# EAGLE design BitUDCounter (EAGLE 9.2.2)
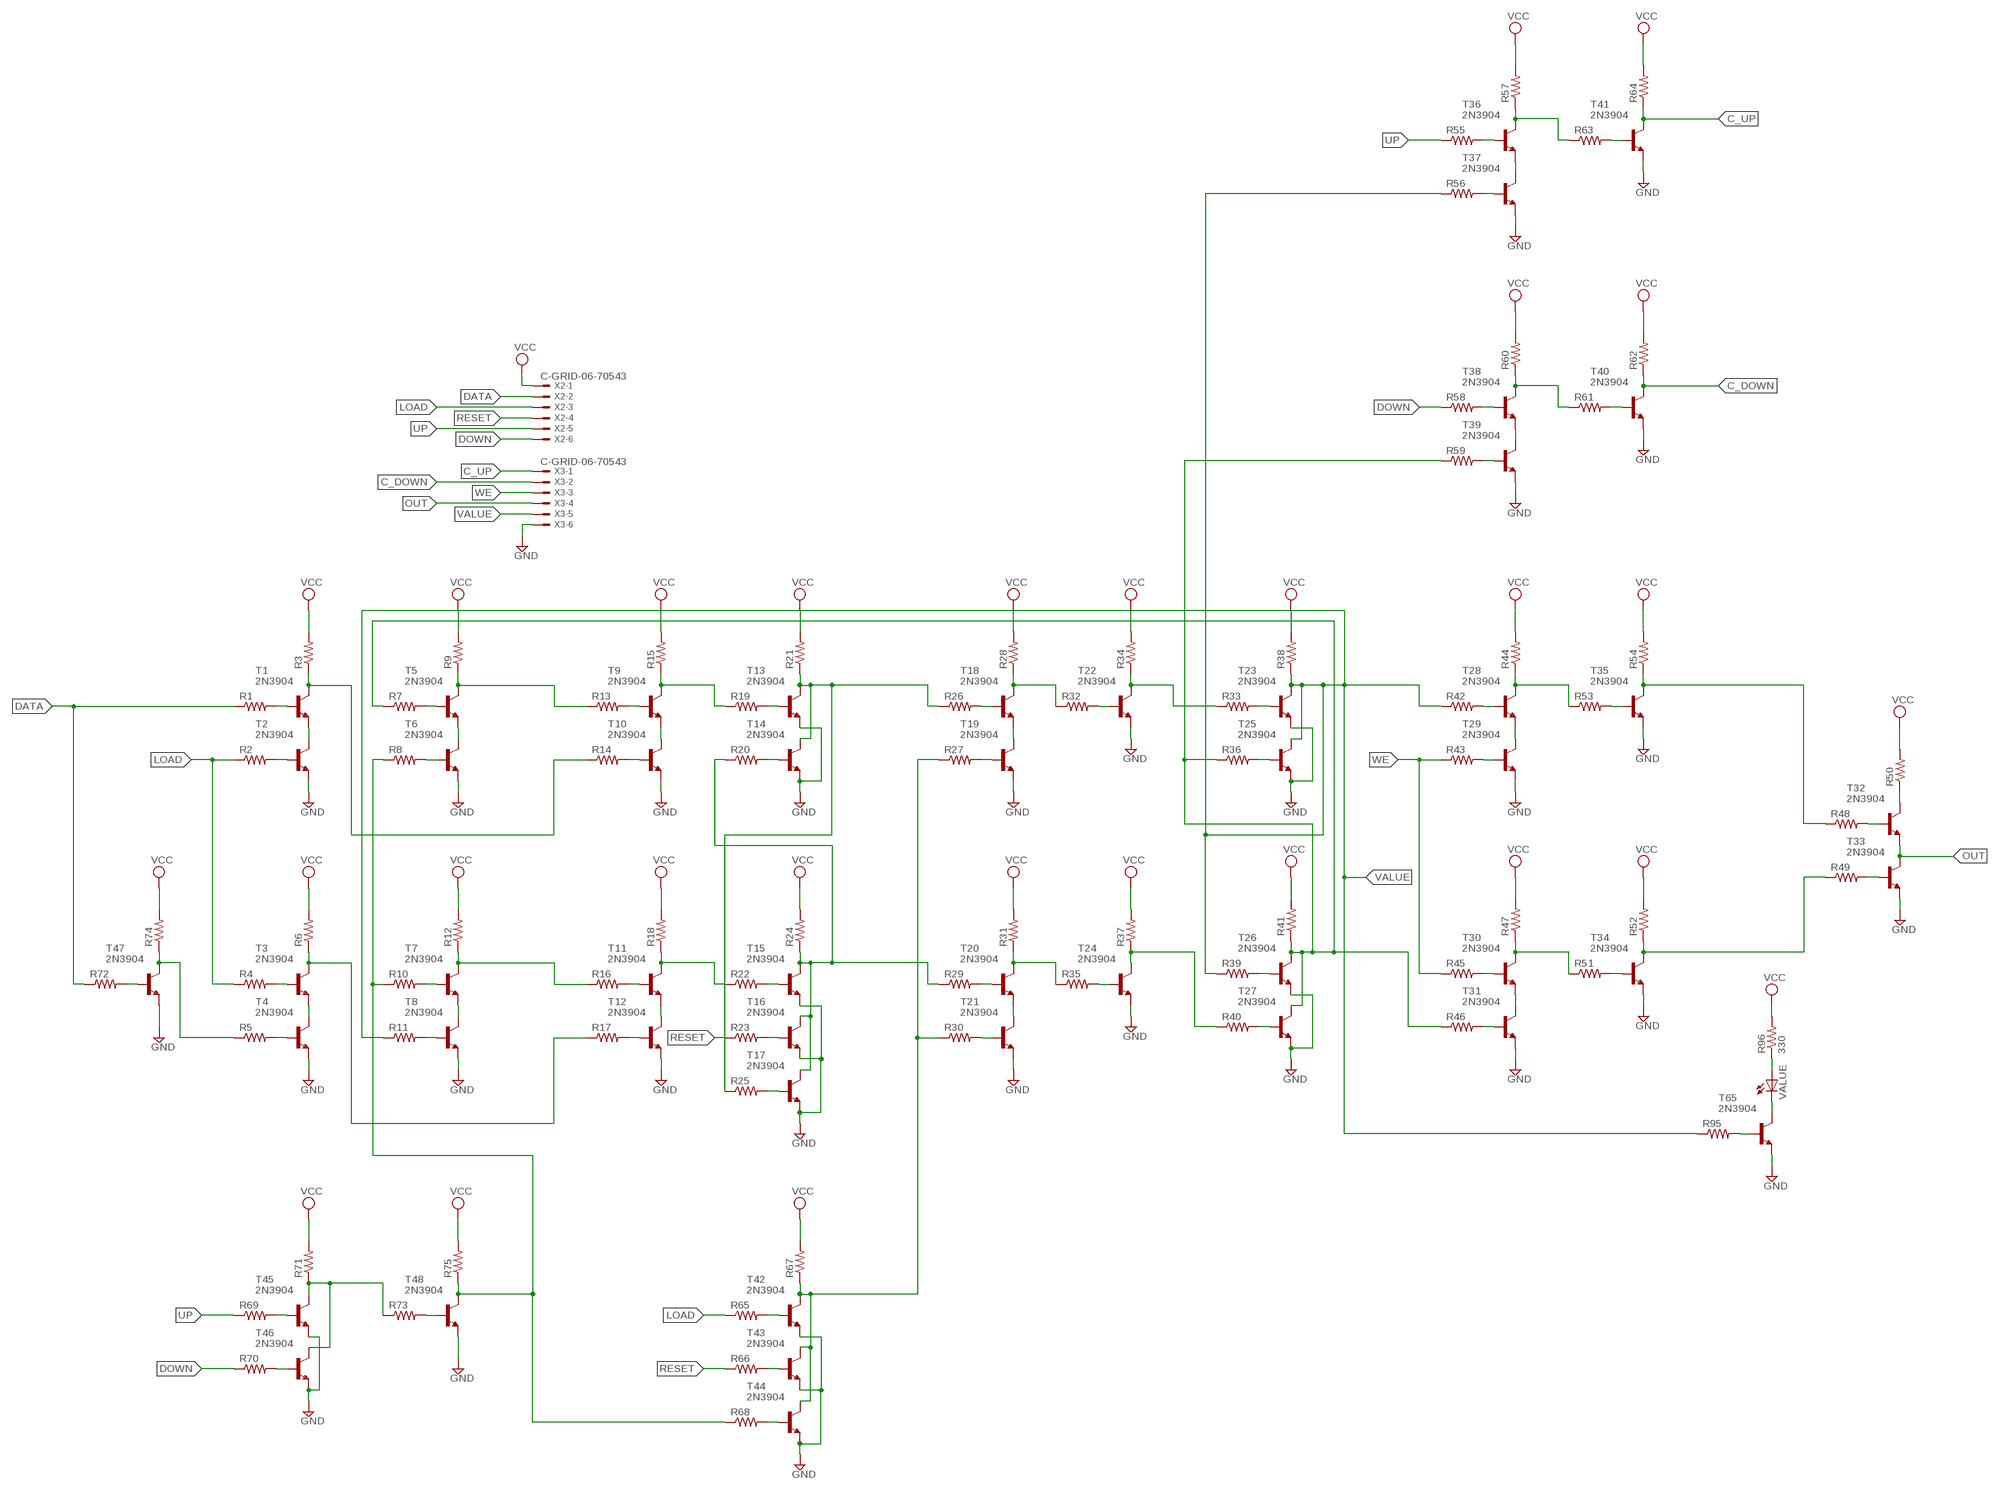
[diagram p0: schematic, sheet 1]

## Parts
R1  R-US_0309/10  [0309/10]
R2  R-US_0309/10  [0309/10]
R3  R-US_0309/10  [0309/10]
R4  R-US_0309/10  [0309/10]
R5  R-US_0309/10  [0309/10]
R6  R-US_0309/10  [0309/10]
R7  R-US_0309/10  [0309/10]
R8  R-US_0309/10  [0309/10]
R9  R-US_0309/10  [0309/10]
R10  R-US_0309/10  [0309/10]
R11  R-US_0309/10  [0309/10]
R12  R-US_0309/10  [0309/10]
R13  R-US_0309/10  [0309/10]
R14  R-US_0309/10  [0309/10]
R15  R-US_0309/10  [0309/10]
R16  R-US_0309/10  [0309/10]
R17  R-US_0309/10  [0309/10]
R18  R-US_0309/10  [0309/10]
R19  R-US_0309/10  [0309/10]
R20  R-US_0309/10  [0309/10]
R21  R-US_0309/10  [0309/10]
R22  R-US_0309/10  [0309/10]
R23  R-US_0309/10  [0309/10]
R24  R-US_0309/10  [0309/10]
R25  R-US_0309/10  [0309/10]
R26  R-US_0309/10  [0309/10]
R27  R-US_0309/10  [0309/10]
R28  R-US_0309/10  [0309/10]
R29  R-US_0309/10  [0309/10]
R30  R-US_0309/10  [0309/10]
R31  R-US_0309/10  [0309/10]
R32  R-US_0309/10  [0309/10]
R33  R-US_0309/10  [0309/10]
R34  R-US_0309/10  [0309/10]
R35  R-US_0309/10  [0309/10]
R36  R-US_0309/10  [0309/10]
R37  R-US_0309/10  [0309/10]
R38  R-US_0309/10  [0309/10]
R39  R-US_0309/10  [0309/10]
R40  R-US_0309/10  [0309/10]
R41  R-US_0309/10  [0309/10]
R42  R-US_0309/10  [0309/10]
R43  R-US_0309/10  [0309/10]
R44  R-US_0309/10  [0309/10]
R45  R-US_0309/10  [0309/10]
R46  R-US_0309/10  [0309/10]
R47  R-US_0309/10  [0309/10]
R48  R-US_0309/10  [0309/10]
R49  R-US_0309/10  [0309/10]
R50  R-US_0309/10  [0309/10]
R51  R-US_0309/10  [0309/10]
R52  R-US_0309/10  [0309/10]
R53  R-US_0309/10  [0309/10]
R54  R-US_0309/10  [0309/10]
R55  R-US_0309/10  [0309/10]
R56  R-US_0309/10  [0309/10]
R57  R-US_0309/10  [0309/10]
R58  R-US_0309/10  [0309/10]
R59  R-US_0309/10  [0309/10]
R60  R-US_0309/10  [0309/10]
R61  R-US_0309/10  [0309/10]
R62  R-US_0309/10  [0309/10]
R63  R-US_0309/10  [0309/10]
R64  R-US_0309/10  [0309/10]
R65  R-US_0309/10  [0309/10]
R66  R-US_0309/10  [0309/10]
R67  R-US_0309/10  [0309/10]
R68  R-US_0309/10  [0309/10]
R69  R-US_0309/10  [0309/10]
R70  R-US_0309/10  [0309/10]
R71  R-US_0309/10  [0309/10]
R72  R-US_0309/10  [0309/10]
R73  R-US_0309/10  [0309/10]
R74  R-US_0309/10  [0309/10]
R75  R-US_0309/10  [0309/10]
R95  R-US_0309/10  [0309/10]
R96  330  R-US_0309/10  [0309/10]
T1  2N3904  [TO92]
T2  2N3904  [TO92]
T3  2N3904  [TO92]
T4  2N3904  [TO92]
T5  2N3904  [TO92]
T6  2N3904  [TO92]
T7  2N3904  [TO92]
T8  2N3904  [TO92]
T9  2N3904  [TO92]
T10  2N3904  [TO92]
T11  2N3904  [TO92]
T12  2N3904  [TO92]
T13  2N3904  [TO92]
T14  2N3904  [TO92]
T15  2N3904  [TO92]
T16  2N3904  [TO92]
T17  2N3904  [TO92]
T18  2N3904  [TO92]
T19  2N3904  [TO92]
T20  2N3904  [TO92]
T21  2N3904  [TO92]
T22  2N3904  [TO92]
T23  2N3904  [TO92]
T24  2N3904  [TO92]
T25  2N3904  [TO92]
T26  2N3904  [TO92]
T27  2N3904  [TO92]
T28  2N3904  [TO92]
T29  2N3904  [TO92]
T30  2N3904  [TO92]
T31  2N3904  [TO92]
T32  2N3904  [TO92]
T33  2N3904  [TO92]
T34  2N3904  [TO92]
T35  2N3904  [TO92]
T36  2N3904  [TO92]
T37  2N3904  [TO92]
T38  2N3904  [TO92]
T39  2N3904  [TO92]
T40  2N3904  [TO92]
T41  2N3904  [TO92]
T42  2N3904  [TO92]
T43  2N3904  [TO92]
T44  2N3904  [TO92]
T45  2N3904  [TO92]
T46  2N3904  [TO92]
T47  2N3904  [TO92]
T48  2N3904  [TO92]
T65  2N3904  [TO92]
VALUE  LED5MM  [LED5MM]
X2  C-GRID-06-70543  [70543-06]
X3  C-GRID-06-70543  [70543-06]

## Nets
C_DOWN: R62.1 T40.1(C) X3.2
C_UP: R64.1 T41.1(C) X3.1
DATA: R1.1 R72.1 X2.2
DOWN: R58.1 R70.1 X2.6
GND: T2.3(E) T4.3(E) T6.3(E) T8.3(E) T10.3(E) T12.3(E) T13.3(E) T14.3(E) T15.3(E) T16.3(E) T17.3(E) T19.3(E) T21.3(E) T22.3(E) T23.3(E) T24.3(E) T25.3(E) T26.3(E) T27.3(E) T29.3(E) T31.3(E) T33.3(E) T34.3(E) T35.3(E) T37.3(E) T39.3(E) T40.3(E) T41.3(E) T42.3(E) T43.3(E) T44.3(E) T45.3(E) T46.3(E) T47.3(E) T48.3(E) T65.3(E) X3.6
LOAD: R2.1 R4.1 R65.1 X2.3
N$1: R5.1 R74.1 T47.1(C)
N$2: R72.2 T47.2(B)
N$3: R71.1 R73.1 T45.1(C) T46.1(C)
N$5: R6.1 R17.1 T3.1(C)
N$6: R69.2 T45.2(B)
N$7: R70.2 T46.2(B)
N$8: R73.2 T48.2(B)
N$9: T3.3(E) T4.1(C)
N$10: R5.2 T4.2(B)
N$11: R4.2 T3.2(B)
N$12: R2.2 T2.2(B)
N$13: R1.2 T1.2(B)
N$14: T1.3(E) T2.1(C)
N$15: R3.1 R14.1 T1.1(C)
N$16: R9.1 R13.1 T5.1(C)
N$17: R7.2 T5.2(B)
N$18: R8.2 T6.2(B)
N$19: T5.3(E) T6.1(C)
N$20: R12.1 R16.1 T7.1(C)
N$21: R10.2 T7.2(B)
N$22: R11.2 T8.2(B)
N$23: T7.3(E) T8.1(C)
N$24: R18.1 R22.1 T11.1(C)
N$25: R16.2 T11.2(B)
N$26: R17.2 T12.2(B)
N$27: T11.3(E) T12.1(C)
N$28: R14.2 T10.2(B)
N$29: T9.3(E) T10.1(C)
N$30: R15.1 R19.1 T9.1(C)
N$31: R13.2 T9.2(B)
N$32: R21.1 R25.1 R26.1 T13.1(C) T14.1(C)
N$34: R19.2 T13.2(B)
N$35: R20.2 T14.2(B)
N$36: R20.1 R24.1 R29.1 T15.1(C) T16.1(C) T17.1(C)
N$37: R8.1 R10.1 R68.1 R75.1 T48.1(C)
N$40: R22.2 T15.2(B)
N$41: R23.2 T16.2(B)
N$42: R25.2 T17.2(B)
N$43: R30.2 T21.2(B)
N$44: T20.3(E) T21.1(C)
N$45: R31.1 R35.1 T20.1(C)
N$46: R29.2 T20.2(B)
N$47: R35.2 T24.2(B)
N$49: R26.2 T18.2(B)
N$50: R27.2 T19.2(B)
N$51: T18.3(E) T19.1(C)
N$52: R28.1 R32.1 T18.1(C)
N$53: R32.2 T22.2(B)
N$54: R33.1 R34.1 T22.1(C)
N$58: R36.2 T25.2(B)
N$59: R33.2 T23.2(B)
N$60: R7.1 R36.1 R41.1 R46.1 R59.1 T26.1(C) T27.1(C)
N$62: R39.2 T26.2(B)
N$63: R40.2 T27.2(B)
N$64: R42.2 T28.2(B)
N$65: R43.2 T29.2(B)
N$66: T28.3(E) T29.1(C)
N$67: R44.1 R53.1 T28.1(C)
N$68: R53.2 T35.2(B)
N$69: R48.1 R54.1 T35.1(C)
N$70: R49.1 R52.1 T34.1(C)
N$71: R51.2 T34.2(B)
N$72: R47.1 R51.1 T30.1(C)
N$73: T30.3(E) T31.1(C)
N$74: R46.2 T31.2(B)
N$75: R45.2 T30.2(B)
N$76: R48.2 T32.2(B)
N$77: R50.1 T32.1(C)
N$79: R49.2 T33.2(B)
N$84: R57.1 R63.1 T36.1(C)
N$85: T36.3(E) T37.1(C)
N$86: R56.2 T37.2(B)
N$87: R55.2 T36.2(B)
N$89: R63.2 T41.2(B)
N$91: R65.2 T42.2(B)
N$92: R61.2 T40.2(B)
N$93: R60.1 R61.1 T38.1(C)
N$94: T38.3(E) T39.1(C)
N$95: R59.2 T39.2(B)
N$96: R58.2 T38.2(B)
N$97: R66.2 T43.2(B)
N$98: R68.2 T44.2(B)
N$100: R27.1 R30.1 R67.1 T42.1(C) T43.1(C) T44.1(C)
N$102: R37.1 R40.1 T24.1(C)
N$121: R96.1 VALUE.A
N$122: R95.2 T65.2(B)
N$124: T65.1(C) VALUE.K(C)
OUT: T32.3(E) T33.1(C) X3.4
RESET: R23.1 R66.1 X2.4
UP: R55.1 R69.1 X2.5
VALUE: R11.1 R38.1 R39.1 R42.1 R56.1 R95.1 T23.1(C) T25.1(C) X3.5
VCC: R3.2 R6.2 R9.2 R12.2 R15.2 R18.2 R21.2 R24.2 R28.2 R31.2 R34.2 R37.2 R38.2 R41.2 R44.2 R47.2 R50.2 R52.2 R54.2 R57.2 R60.2 R62.2 R64.2 R67.2 R71.2 R74.2 R75.2 R96.2 X2.1
WE: R43.1 R45.1 X3.3

## Library data of the parts
R1-R75 R95 R96 = resistor:R-US_: RESISTOR, American symbol
T1-T48 T65 = transistor:2N3904: NPN TRANSISTOR
VALUE = led:LED: LED OSRAM: - CHIPLED LG R971, LG N971, LY N971, LG Q971, LY Q971, LO R971, LY R971 LH N974, LH R974 LS Q976, LO Q976, LY Q976 LO Q996 - Hyper CHIPLED LW Q18S LB Q993, LB Q99A, LB R99A - SideLED LS A670, LO A670, LY A670, LG A670, LP A670 LB A673, LV A673, LT A673, LW A673 LH A674 LY A675 LS A676, LA A676, LO A676, LY A676, LW A676 LS A679, LY A679, LG A679 - Hyper Micro SIDELED® LS Y876, LA Y876, LO Y876, LY Y876 LT Y87S - SmartLED LW L88C, LW L88S LB L89C, LB L89S, LG L890 LS L89K, LO L89K, LY L89K LS L896, LA L896, LO L896, LY L896 - TOPLED LS T670, LO T670, LY T670, LG T670, LP T670 LSG T670, LSP T670, LSY T670, LOP T670, LYG T670 LG T671, LOG T671, LSG T671 LB T673, LV T673, LT T673, LW T673 LH T674 LS T676, LA T676, LO T676, LY T676, LB T676, LH T676, LSB T676, LW T676 LB T67C, LV T67C, LT T67C, LS T67K, LO T67K, LY T67K, LW E67C LS E67B, LA E67B, LO E67B, LY E67B, LB E67C, LV E67C, LT E67C LW T67C LS T679, LY T679, LG T679 LS T770, LO T770, LY T770, LG T770, LP T770 LB T773, LV T773, LT T773, LW T773 LH T774 LS E675, LA E675, LY E675, LS T675 LS T776, LA T776, LO T776, LY T776, LB T776 LHGB T686 LT T68C, LB T68C - Hyper Mini TOPLED® LB M676 - Mini TOPLED Santana® LG M470 LS M47K, LO M47K, LY M47K Source: http://www.osram.convergy.de LUXEON: - LUMILED® LXK2-PW12-R00, LXK2-PW12-S00, LXK2-PW14-U00, LXK2-PW14-V00 LXK2-PM12-R00, LXK2-PM12-S00, LXK2-PM14-U00 LXK2-PE12-Q00, LXK2-PE12-R00, LXK2-PE12-S00, LXK2-PE14-T00, LXK2-PE14-U00 LXK2-PB12-K00, LXK2-PB12-L00, LXK2-PB12-M00, LXK2-PB14-N00, LXK2-PB14-P00, LXK2-PB14-Q00 LXK2-PR12-L00, LXK2-PR12-M00, LXK2-PR14-Q00, LXK2-PR14-R00 LXK2-PD12-Q00, LXK2-PD12-R00, LXK2-PD12-S00 LXK2-PH12-R00, LXK2-PH12-S00 LXK2-PL12-P00, LXK2-PL12-Q00, LXK2-PL12-R00 Source: www.luxeon.com KINGBRIGHT: KA-3528ASYC Source: www.kingbright.com
X2 X3 = con-molex:C-GRID-06: CONNECTOR wire to board 2.54 mm (0.100") pitch header; MF: MOLEX; OC_FARNELL: unknown; OC_NEWARK: unknown

## Board
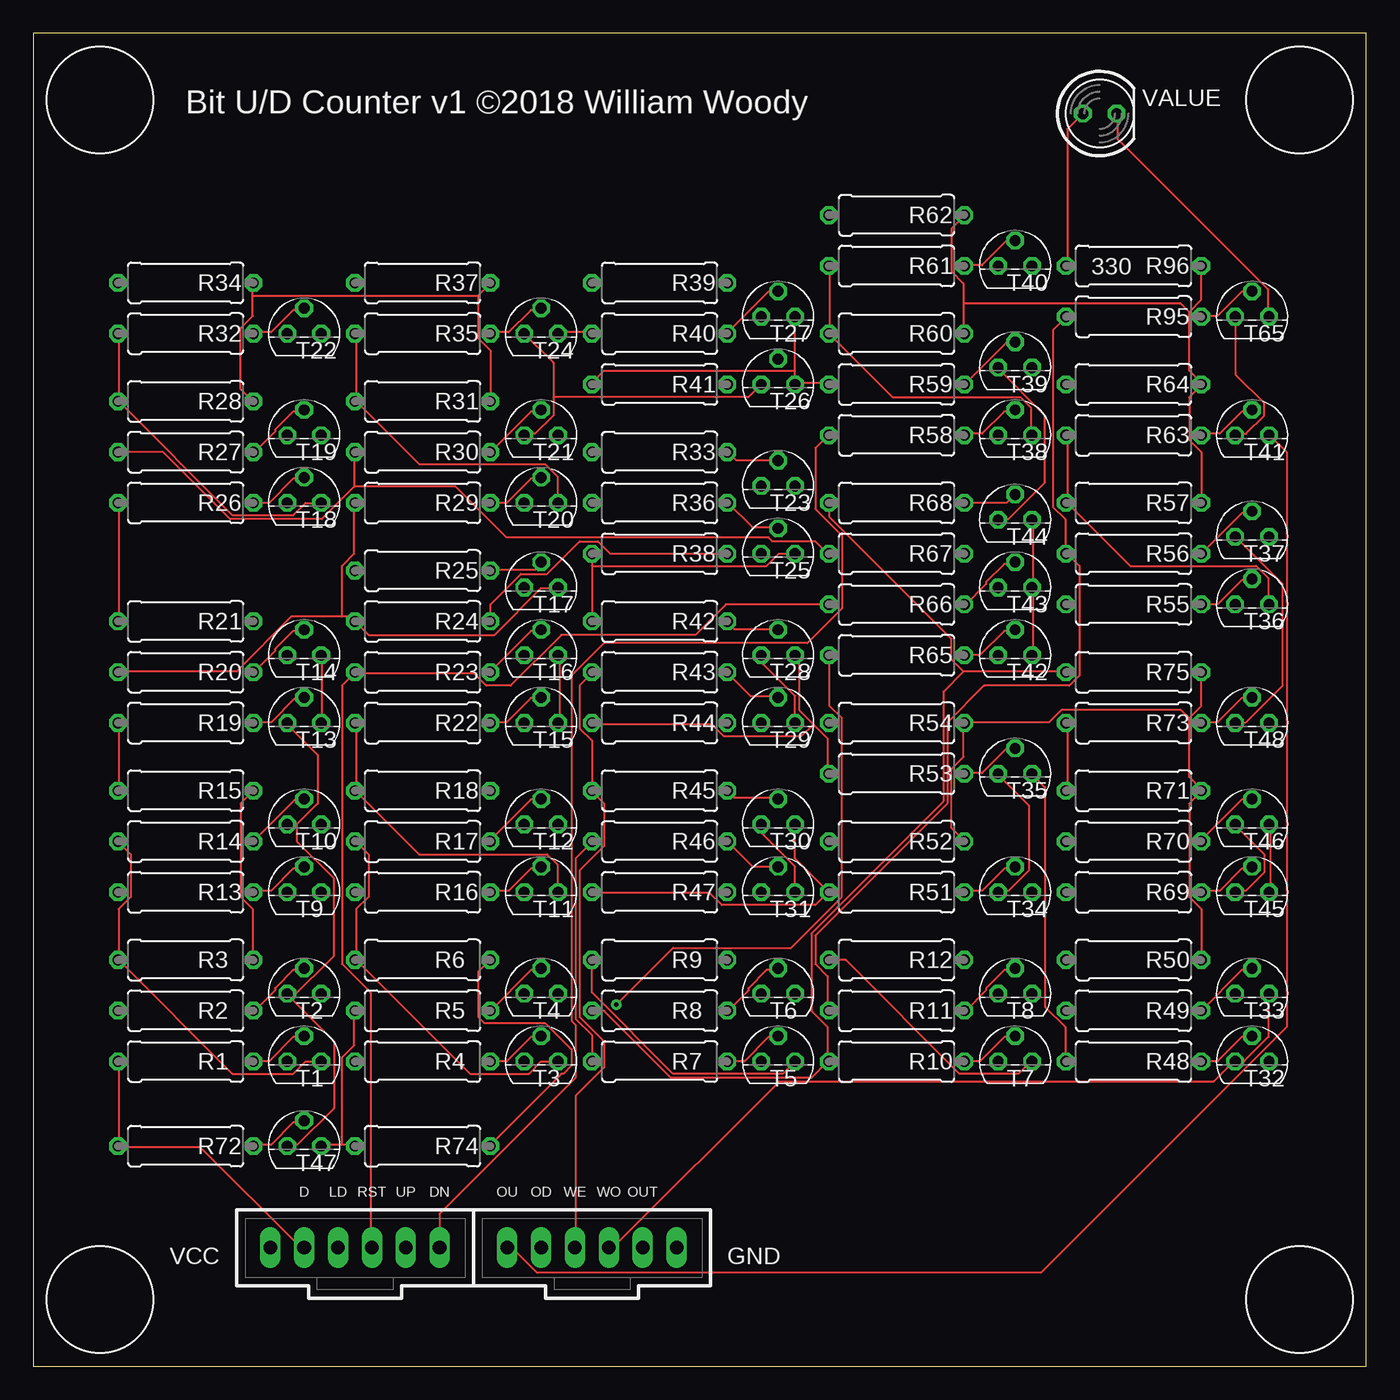
[diagram p1: board, top side]
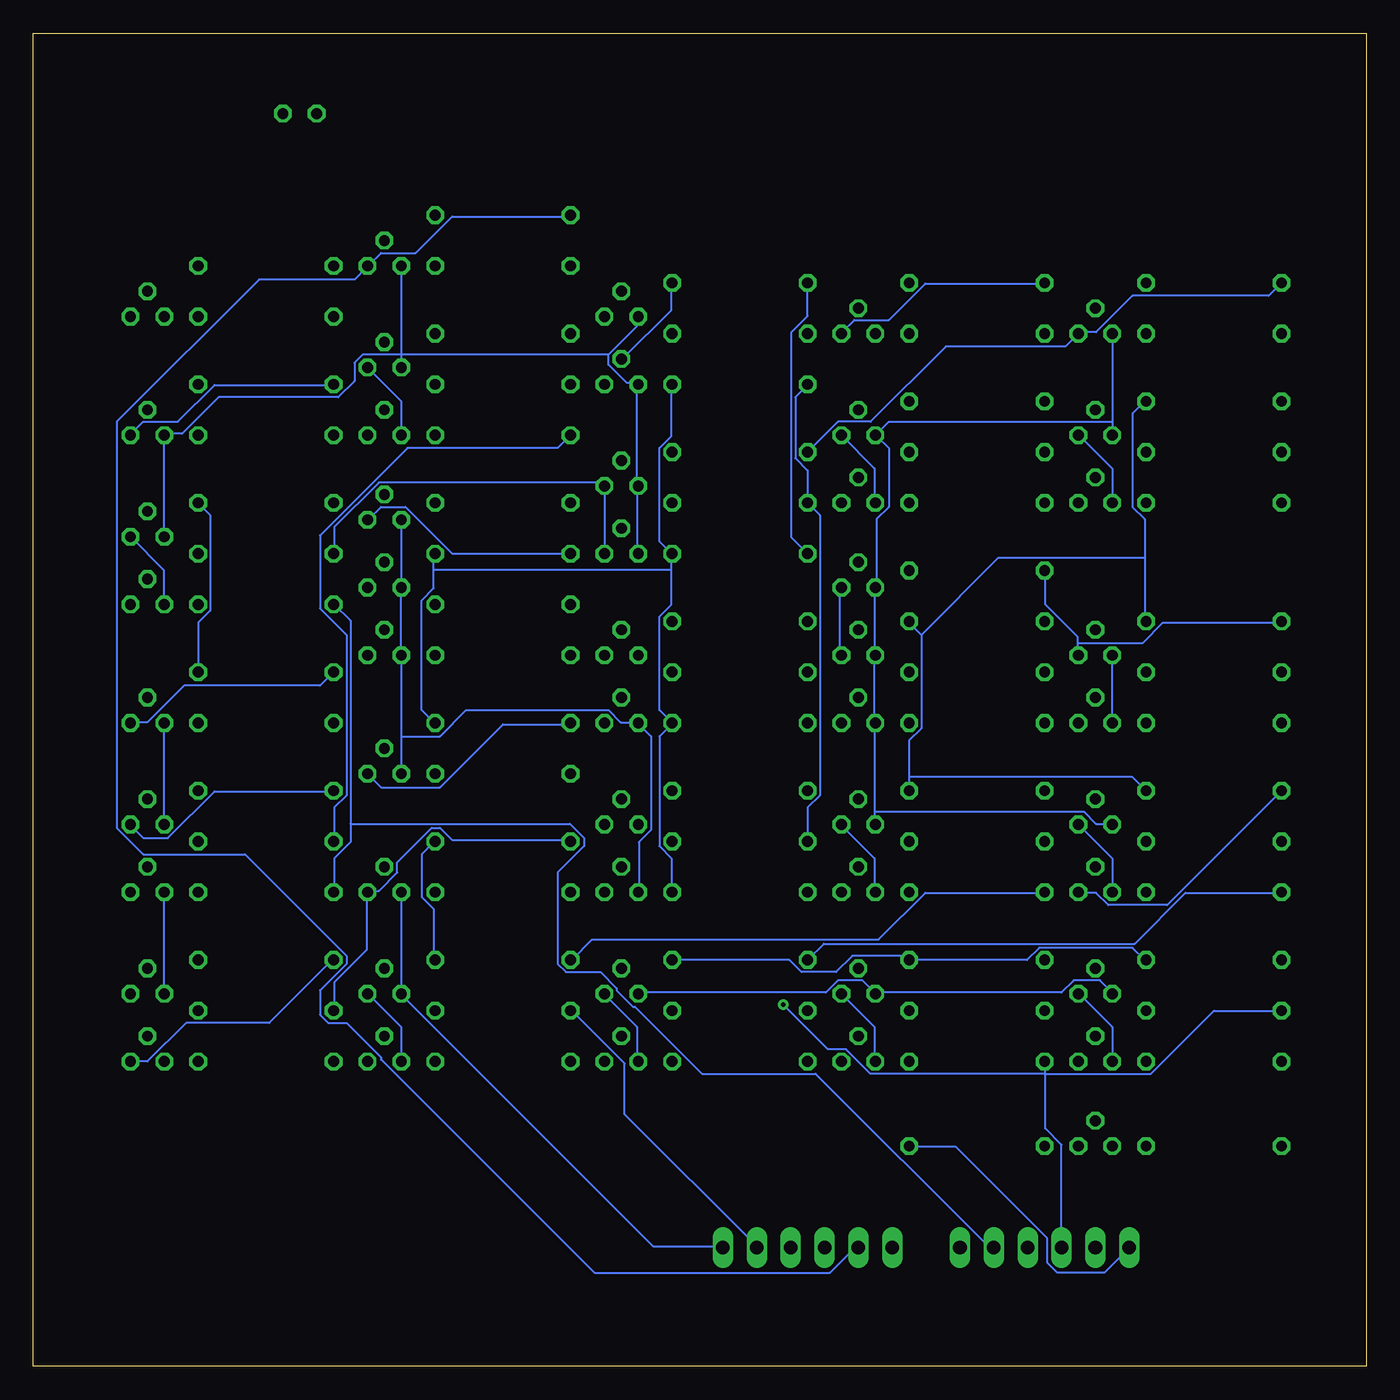
[diagram p2: board, bottom side, seen from below]

Size 100 x 100 mm. Coordinates in mm from the lower left corner, seen from the top.
Outline: 0,0 100,0 100,100 0,100 0,0
Copper layers (1*16): Top 0.035mm / dielectric 1.5mm / Bottom 0.035mm
Design rules "default": minimum track width 6mil, minimum drill 0.35mm, track to track 6mil, track to pad 6mil, pad to pad 6mil, via to via 6mil, smd to smd 6mil, copper to edge 40mil, drill to drill 6mil, minimum pad ring 10mil, minimum via ring 8mil, stop-mask expansion 4mil, vias tented up to drill 0mil, thermal gap 10mil

### Footprints (pad centres in the part's own frame; a part is rotated, then mirrored left to right if it is on the bottom)
0309/10 = drill 0.813 octagon: 1 -5.08,0; 2 5.08,0
TO92 = drill 0.813 octagon: 1 1.27,0; 2 0,1.905; 3 -1.27,0
LED5MM = drill 0.813 octagon: A -1.27,0; K 1.27,0
70543-06 = drill 1.016 long: 1 -6.35,0; 2 -3.81,0; 3 -1.27,0; 4 1.27,0; 5 3.81,0; 6 6.35,0

### Placement (x,y rotation side)
R1  11.43,22.86 0 top
R2  11.43,26.67 0 top
R3  11.43,30.48 0 top
R4  29.21,22.86 0 top
R5  29.21,26.67 0 top
R6  29.21,30.48 0 top
R7  46.99,22.86 0 top
R8  46.99,26.67 0 top
R9  46.99,30.48 0 top
R10  64.77,22.86 0 top
R11  64.77,26.67 0 top
R12  64.77,30.48 0 top
R13  11.43,35.56 0 top
R14  11.43,39.37 0 top
R15  11.43,43.18 0 top
R16  29.21,35.56 0 top
R17  29.21,39.37 0 top
R18  29.21,43.18 0 top
R19  11.43,48.26 0 top
R20  11.43,52.07 0 top
R21  11.43,55.88 0 top
R22  29.21,48.26 0 top
R23  29.21,52.07 0 top
R24  29.21,55.88 0 top
R25  29.21,59.69 0 top
R26  11.43,64.77 0 top
R27  11.43,68.58 0 top
R28  11.43,72.39 0 top
R29  29.21,64.77 0 top
R30  29.21,68.58 0 top
R31  29.21,72.39 0 top
R32  11.43,77.47 0 top
R33  46.99,68.58 0 top
R34  11.43,81.28 0 top
R35  29.21,77.47 0 top
R36  46.99,64.77 0 top
R37  29.21,81.28 0 top
R38  46.99,60.96 0 top
R39  46.99,81.28 0 top
R40  46.99,77.47 0 top
R41  46.99,73.66 0 top
R42  46.99,55.88 0 top
R43  46.99,52.07 0 top
R44  46.99,48.26 0 top
R45  46.99,43.18 0 top
R46  46.99,39.37 0 top
R47  46.99,35.56 0 top
R48  82.55,22.86 0 top
R49  82.55,26.67 0 top
R50  82.55,30.48 0 top
R51  64.77,35.56 0 top
R52  64.77,39.37 0 top
R53  64.77,44.45 0 top
R54  64.77,48.26 0 top
R55  82.55,57.15 0 top
R56  82.55,60.96 0 top
R57  82.55,64.77 0 top
R58  64.77,69.85 0 top
R59  64.77,73.66 0 top
R60  64.77,77.47 0 top
R61  64.77,82.55 0 top
R62  64.77,86.36 0 top
R63  82.55,69.85 0 top
R64  82.55,73.66 0 top
R65  64.77,53.34 0 top
R66  64.77,57.15 0 top
R67  64.77,60.96 0 top
R68  64.77,64.77 0 top
R69  82.55,35.56 0 top
R70  82.55,39.37 0 top
R71  82.55,43.18 0 top
R72  11.43,16.51 0 top
R73  82.55,48.26 0 top
R74  29.21,16.51 0 top
R75  82.55,52.07 0 top
R95  82.55,78.74 0 top
R96  82.55,82.55 0 top
T1  20.32,22.86 0 top
T2  20.32,27.94 0 top
T3  38.1,22.86 0 top
T4  38.1,27.94 0 top
T5  55.88,22.86 0 top
T6  55.88,27.94 0 top
T7  73.66,22.86 0 top
T8  73.66,27.94 0 top
T9  20.32,35.56 0 top
T10  20.32,40.64 0 top
T11  38.1,35.56 0 top
T12  38.1,40.64 0 top
T13  20.32,48.26 0 top
T14  20.32,53.34 0 top
T15  38.1,48.26 0 top
T16  38.1,53.34 0 top
T17  38.1,58.42 0 top
T18  20.32,64.77 0 top
T19  20.32,69.85 0 top
T20  38.1,64.77 0 top
T21  38.1,69.85 0 top
T22  20.32,77.47 0 top
T23  55.88,66.04 0 top
T24  38.1,77.47 0 top
T25  55.88,60.96 0 top
T26  55.88,73.66 0 top
T27  55.88,78.74 0 top
T28  55.88,53.34 0 top
T29  55.88,48.26 0 top
T30  55.88,40.64 0 top
T31  55.88,35.56 0 top
T32  91.44,22.86 0 top
T33  91.44,27.94 0 top
T34  73.66,35.56 0 top
T35  73.66,44.45 0 top
T36  91.44,57.15 0 top
T37  91.44,62.23 0 top
T38  73.66,69.85 0 top
T39  73.66,74.93 0 top
T40  73.66,82.55 0 top
T41  91.44,69.85 0 top
T42  73.66,53.34 0 top
T43  73.66,58.42 0 top
T44  73.66,63.5 0 top
T45  91.44,35.56 0 top
T46  91.44,40.64 0 top
T47  20.32,16.51 0 top
T48  91.44,48.26 0 top
T65  91.44,78.74 0 top
VALUE  80.01,93.98 0 top
X2  24.13,8.89 0 top
X3  41.91,8.89 0 top

### Tracks (layer width: path | path; a pad name or v marks a point on that pad's centre or on a via)
C_DOWN
  Bottom 0.152: R62.1 59.74,86.26 68.58,86.26 71.32,83.52 73.91,83.52 74.83,82.6 T40.1 74.98,82.45 75.89,81.53 83.06,81.53 93.73,70.87 93.73,40.39 91.75,38.41 84.12,38.41 76.5,30.79 76.5,30.18 78.49,28.19 78.49,26.36 77.88,25.76 76.5,25.76 73.91,23.16 73.91,23.01 57.91,7.01 40.23,7.01 38.41,8.84 38.1,8.84 X3.2
C_UP
  Top 0.152: X3.1 35.66,8.84 35.97,8.84 37.8,7.01 75.59,7.01 94.03,25.45 94.03,68.58 92.81,69.8 T41.1
  Bottom 0.152: R64.1 77.57,73.61 86.41,73.61 89.15,70.87 91.75,70.87 92.66,69.95 T41.1
DATA
  Top 0.152: R1.1 6.4,22.86 6.4,16.61 R72.1 6.4,16.46 12.5,16.46 19.96,8.99 20.27,8.99 X2.2
DOWN
  Top 0.152: X2.6 30.48,11.43 40.69,21.64 40.69,25.6 40.39,25.91 40.39,51.82 42.82,54.25 58.06,54.25 60.66,56.84 60.66,62.33 58.67,64.31 58.67,68.89 59.59,69.8 R58.1
  Bottom 0.152: R58.1 60.66,68.89 71.93,68.89 78.49,62.33 78.49,56.84 76.5,54.86 76.5,42.82 77.42,41.91 77.42,39.47 R70.1
GND
  Top 0.152: 19.81,40.69 19.05,40.69 T10.3 | 19.81,40.69 21.34,42.22 21.34,45.87 19.05,48.16 T13.3 | 19.36,27.58 19.05,27.89 T2.3 19.36,27.58 | 19.36,27.58 22.55,24.38 22.55,19.36 19.81,16.61 19.05,16.61 T47.3 | 19.81,40.69 19.81,39.32 22.55,36.58 22.55,30.79 19.36,27.58 | 39.01,72.69 39.01,75.29 T24.3 | 39.01,72.69 39.01,71.32 37.64,69.95 36.88,69.95 T21.3 | T65.3 90.22,78.64 90.22,74.37 92.35,72.24 92.35,71.32 90.98,69.95 90.22,69.95 T41.3 | T45.3 90.22,35.66 90.98,35.66 92.35,37.03 92.35,38.41 90.22,40.54 T46.3 | T37.3 93.73,58.67 93.73,51.05 90.98,48.31 90.22,48.31 T48.3 | T39.3 72.39,74.83 75.89,71.32 75.89,66.29 73.15,63.55 72.39,63.55 T44.3 | T34.3 72.39,35.66 73.15,35.66 74.68,37.19 74.68,42.06 72.39,44.35 T35.3 | 39.01,72.69 53.65,72.69 T26.3
  Bottom 0.152: T13.3 T14.3 | T2.3 19.05,28.04 19.96,28.96 21.95,28.96 22.86,28.04 36.73,28.04 T4.3 36.88,28.04 37.8,28.96 39.62,28.96 40.54,28.04 54.56,28.04 T6.3 | 36.88,53.34 36.88,58.37 T17.3 36.73,58.52 36.73,63.55 35.81,64.47 35.81,68.89 36.73,69.8 T21.3 35.81,70.87 19.05,70.87 | 36.88,41.6 36.88,48.16 T15.3 36.88,48.31 36.88,53.34 | 36.88,41.6 36.88,40.69 T12.3 | 36.88,53.34 T16.3 | T22.3 19.05,70.87 | 19.05,70.87 T19.3 | T37.3 90.22,62.33 90.22,69.8 T41.3 90.07,69.95 88.85,69.95 86.11,72.69 77.11,72.69 75.89,73.91 75.89,75.29 75.29,75.89 72.39,75.89 | T33.3 90.22,28.04 90.22,35.51 T45.3 | T46.3 90.22,40.69 90.22,48.16 T48.3 | T34.3 T8.3 72.39,27.89 53.49,8.99 48.31,8.99 X3.6 | T40.3 72.39,75.89 | 72.39,75.89 T39.3 | T25.3 54.71,60.96 54.71,65.99 T23.3 54.71,66.14 54.71,73.61 T26.3 54.71,73.76 55.47,73.76 56.84,75.13 56.84,75.89 | 56.84,75.89 54.71,78.03 54.71,78.64 T27.3 | 56.84,75.89 72.39,75.89 | T31.3 54.56,35.66 54.56,39.32 53.65,40.23 53.65,47.24 54.56,48.16 T29.3 54.71,48.31 55.93,48.31 56.84,49.23 67.51,49.23 69.49,47.24 72.39,47.24 | T44.3 T43.3 T42.3 72.39,47.24 | 72.39,47.24 T35.3 | 36.88,41.6 21.18,41.6 20.27,40.69 19.05,40.69 T10.3
LOAD  (via drill 0.35)
  Top 0.152: v43.74,27.13 48.01,31.39 56.84,31.39 60.66,35.2 60.66,48.62 59.74,49.53 59.74,53.34 R65.1
  Bottom 0.152: 24.08,21.95 24.08,17.83 22.86,16.61 X2.3 | 24.08,21.95 24.08,22.86 R4.1 | R2.1 11.43,26.67 16.15,21.95 24.08,21.95 | v43.74,27.13 40.39,23.77 39.01,23.77 37.19,21.95 24.08,21.95
N$1
  Top 0.152: 23.16,16.61 24.08,16.61 R74.1 | 23.16,16.61 21.64,16.61 T47.1 | 23.16,16.61 23.16,23.16 24.08,24.08 24.08,26.67 R5.1
N$2
  Top 0.152: R72.2 16.61,16.61 17.83,16.61 19.51,18.29 20.27,18.29 T47.2
N$3
  Top 0.152: R71.1 77.57,43.28 77.57,48.16 R73.1 | T45.1 92.81,35.66 92.81,40.54 T46.1
  Bottom 0.152: R71.1 77.57,43.13 86.41,43.13 89.92,39.62 91.75,39.62 92.66,40.54 T46.1
N$5
  Top 0.152: 24.23,30.48 24.23,34.29 25.15,35.2 25.15,38.41 24.23,39.32 R17.1 | T3.1 38.1,22.86 37.19,21.95 32.77,21.95 24.23,30.48 | 24.23,30.48 R6.1
N$6
  Top 0.152: R69.2 87.63,35.66 89,35.66 90.68,37.34 91.44,37.34 T45.2
N$7
  Top 0.152: R70.2 87.63,39.47 90.68,42.52 91.44,42.52 T46.2
N$8
  Top 0.152: R73.2 87.63,48.31 88.85,48.31 90.68,50.14 91.44,50.14 T48.2
N$9
  Bottom 0.152: T4.1 36.88,25.45 36.88,22.86 T3.3
N$10
  Top 0.152: R5.2 37.34,29.72 38.1,29.72 T4.2
N$11
  Top 0.152: R4.2 35.51,22.86 37.34,24.69 38.1,24.69 T3.2
N$12
  Top 0.152: R2.2 16.61,26.67 18.14,28.19 18.14,28.35 19.51,29.72 20.27,29.72 T2.2
N$13
  Top 0.152: R1.2 17.68,22.86 19.51,24.69 20.27,24.69 T1.2
N$14
  Bottom 0.152: T1.3 19.05,25.45 21.49,27.89 T2.1
N$15
  Top 0.152: 6.4,30.48 6.4,34.29 7.32,35.2 7.32,38.41 R14.1 | T1.1 20.42,22.86 19.51,21.95 14.94,21.95 6.4,30.48 | 6.4,30.48 R3.1
N$16
  Top 0.152: R9.1 41.91,28.04 48.01,21.95 56.24,21.95 T5.1
  Bottom 0.152: R9.1 40.69,31.7 17.37,31.7 13.56,35.51 6.4,35.51 R13.1
N$17
  Top 0.152: R7.2 53.34,22.86 55.17,24.69 55.78,24.69 T5.2
N$18
  Top 0.152: R8.2 52.12,26.67 53.65,28.19 53.65,28.35 55.02,29.72 55.78,29.72 T6.2
N$19
  Bottom 0.152: T5.3 54.71,22.86 54.71,25.45 57.15,27.89 T6.1
N$20
  Top 0.152: R12.1 60.96,30.48 69.49,21.95 73.91,21.95 74.83,22.86 T7.1
  Bottom 0.152: R16.1 24.23,35.51 33.07,35.51 36.58,32 58.06,32 59.59,30.48 R12.1
N$21
  Top 0.152: R10.2 71.02,22.86 72.85,24.69 73.61,24.69 T7.2
N$22
  Top 0.152: R11.2 69.95,26.67 71.48,28.19 71.48,28.35 72.85,29.72 73.61,29.72 T8.2
N$23
  Bottom 0.152: T7.3 72.39,25.45 74.83,27.89 T8.1
N$24
  Top 0.152: R22.1 24.23,48.16 24.23,43.28 R18.1 24.23,43.13 28.96,38.41 38.56,38.41 39.32,37.64 39.32,35.66 T11.1
N$25
  Top 0.152: R16.2 34.29,35.66 35.66,35.66 37.34,37.34 38.1,37.34 T11.2
N$26
  Top 0.152: R17.2 34.29,39.47 37.34,42.52 38.1,42.52 T12.2
N$27
  Bottom 0.152: T11.3 36.88,35.66 36.88,38.1 39.32,40.54 T12.1
N$28
  Top 0.152: R14.2 19.66,42.52 20.27,42.52 T10.2
N$29
  Bottom 0.152: T9.3 19.05,38.1 T10.1
N$30
  Top 0.152: R15.1 6.4,43.28 6.4,48.16 R19.1
  Bottom 0.152: R15.1 14.94,34.59 19.36,34.59 20.27,35.51 21.49,35.51 T9.1
N$31
  Top 0.152: R13.2 16.61,35.66 17.83,35.66 19.51,37.34 20.27,37.34 T9.2
N$32
  Top 0.152: R21.1 6.4,55.93 6.4,64.77 R26.1 | T13.1 21.64,48.31 21.64,53.34 T14.1
  Bottom 0.152: 21.64,54.25 21.64,53.34 T14.1 | 21.64,54.25 21.64,54.71 24.08,57.15 24.08,59.59 R25.1 | 21.64,54.25 16.76,54.25 15.24,55.78 6.4,55.78 R21.1
N$34
  Top 0.152: R19.2 16.61,48.31 17.83,48.31 19.66,50.14 20.27,50.14 T13.2
N$35
  Top 0.152: R20.2 16.61,52.12 18.14,53.65 18.14,53.8 19.51,55.17 20.27,55.17 T14.2
N$36
  Top 0.152: T15.1 39.47,48.31 39.47,53.34 T16.1 | 23.16,56.24 23.77,56.24 R24.1 25.15,54.86 34.59,54.86 38.1,58.37 39.32,58.37 T17.1 | 23.16,56.24 19.36,56.24 15.24,52.12 6.4,52.12 R20.1 | 23.16,56.24 23.16,60.05 24.08,60.96 24.08,64.77 R29.1
  Bottom 0.152: T17.1 39.47,58.37 39.47,53.34 T16.1
N$37
  Top 0.152: R8.1 42.82,26.67 47.85,21.64 58.37,21.64 59.59,22.86 | 69.8,52.12 68.89,53.03 68.89,54.56 59.74,63.7 59.74,64.77 R68.1 | 69.8,52.12 77.42,52.12 R75.1 | 59.59,22.86 59.59,25.45 58.37,26.67 58.37,32.46 68.28,42.37 68.28,50.6 69.8,52.12 | 59.59,22.86 R10.1
  Bottom 0.152: R75.1 78.49,51.05 88.7,51.05 91.44,48.31 92.66,48.31 T48.1
N$40
  Top 0.152: R22.2 34.29,48.31 35.51,48.31 37.34,50.14 38.1,50.14 T15.2
N$41
  Top 0.152: R23.2 34.29,52.12 37.34,55.17 38.1,55.17 T16.2
N$42
  Top 0.152: R25.2 34.29,59.74 37.64,59.74 38.1,60.2 T17.2
N$43
  Top 0.152: R30.2 37.34,71.63 38.1,71.63 T21.2
N$44
  Bottom 0.152: T21.1 36.88,67.36 36.88,64.77 T20.3
N$45
  Top 0.152: 24.23,72.39 24.23,77.42 R35.1 | 24.23,72.39 28.96,67.67 38.41,67.67 39.32,66.75 39.32,64.77 T20.1 | 24.23,72.39 R31.1
N$46
  Top 0.152: R29.2 35.51,64.77 37.34,66.6 38.1,66.6 T20.2
N$47
  Top 0.152: R35.2 34.29,77.57 35.66,77.57 37.34,79.25 38.1,79.25 T24.2
N$49
  Top 0.152: R26.2 17.68,64.77 19.51,66.6 20.27,66.6 T18.2
N$50
  Top 0.152: R27.2 16.61,68.58 18.14,70.1 18.14,70.26 19.51,71.63 20.27,71.63 T19.2
N$51
  Bottom 0.152: T18.3 19.05,67.36 21.49,69.8 T19.1
N$52
  Top 0.152: 6.4,72.39 6.4,77.42 R32.1 | T18.1 20.42,64.77 19.51,63.86 14.94,63.86 6.4,72.39 | 6.4,72.39 R28.1
N$53
  Top 0.152: R32.2 16.61,77.57 17.83,77.57 19.51,79.25 20.27,79.25 T22.2
N$54
  Bottom 0.152: R34.1 7.32,80.31 17.53,80.31 20.27,77.57 21.49,77.57 T22.1 22.55,76.5 31.55,76.5 37.19,70.87 39.62,70.87 R33.1
N$58
  Top 0.152: T25.2 55.78,62.94 53.95,62.94 52.12,64.77 R36.2
N$59
  Top 0.152: T23.2 55.78,67.97 52.73,67.97 52.12,68.58 R33.2
N$60
  Top 0.152: R7.1 41.91,24.84 40.69,26.06 40.69,38.1 41.91,39.32 R46.1 | 57.15,73.76 59.59,73.76 R59.1 | 57.15,73.76 57.15,74.68 | 57.15,74.68 T27.1 | 57.15,73.76 T26.1 | 57.15,74.68 42.82,74.68 41.91,73.76 R41.1
  Bottom 0.152: R41.1 41.91,73.61 42.82,72.69 42.82,68.12 41.91,67.21 R36.1 41,63.86 41,42.82 41.91,41.91 R46.1
N$62
  Bottom 0.152: R39.2 52.12,81.23 52.12,79.25 55.78,75.59 T26.2
N$63
  Top 0.152: R40.2 52.12,77.57 55.17,80.62 55.78,80.62 T27.2
N$64
  Top 0.152: T28.2 55.78,55.32 52.58,55.32 52.12,55.78 R42.2
N$65
  Top 0.152: T29.2 55.78,50.29 53.8,50.29 52.12,51.97 R43.2
N$66
  Top 0.152: T29.1 57.15,50.29 54.71,52.73 54.71,53.34 T28.3
N$67
  Top 0.152: 58.52,48.16 57.45,49.23 57.45,53.03 T28.1 | 58.52,48.16 59.59,47.09 59.59,44.5 R53.1 | 58.52,48.16 57.61,47.24 51.82,47.24 50.9,48.16 41.91,48.16 R44.1
N$68
  Top 0.152: R53.2 69.95,44.5 71.17,44.5 73,46.33 73.61,46.33 T35.2
N$69
  Top 0.152: R48.1 77.42,22.86 77.42,25.45 75.89,26.98 75.89,43.43 74.98,44.35 T35.1
  Bottom 0.152: T35.1 73.91,43.43 69.49,43.43 64.77,48.16 59.74,48.16 R54.1
N$70
  Bottom 0.152: R49.1 77.42,26.67 77.42,28.8 74.98,31.24 74.98,35.51 T34.1 74.83,35.66 74.07,35.66 72.69,37.03 72.69,37.8 70.1,40.39 69.49,40.39 68.58,39.47 59.74,39.47 R52.1
N$71
  Top 0.152: R51.2 69.95,35.66 71.17,35.66 72.85,37.34 73.61,37.34 T34.2
N$72
  Top 0.152: R47.1 41.91,35.51 50.75,35.51 51.66,34.59 58.67,34.59 59.59,35.51 R51.1 57.15,38.1 T30.1
N$73
  Top 0.152: T31.1 57.15,37.49 54.71,39.93 54.71,40.54 T30.3
N$74
  Top 0.152: R46.2 53.95,37.49 55.78,37.49 T31.2
N$75
  Top 0.152: R45.2 52.58,42.67 55.78,42.67 T30.2
N$76
  Top 0.152: R48.2 88.85,22.86 90.68,24.69 91.44,24.69 T32.2
N$77
  Bottom 0.152: T32.1 91.44,22.86 88.54,25.76 82.3,25.76 77.57,30.48 R50.1
N$79
  Top 0.152: R49.2 90.68,29.72 91.44,29.72 T33.2
N$84
  Top 0.152: 77.57,64.77 77.57,69.8 R63.1 | 77.57,64.77 82.3,60.05 91.75,60.05 92.66,59.13 92.66,57.15 T36.1 | 77.57,64.77 R57.1
N$85
  Bottom 0.152: T37.1 90.22,59.74 90.22,57.15 T36.3
N$86
  Top 0.152: R56.2 90.68,64.01 91.44,64.01 T37.2
N$87
  Top 0.152: R55.2 88.85,57.15 90.68,58.98 91.44,58.98 T36.2
N$89
  Top 0.152: R63.2 87.63,69.95 89,69.95 90.68,71.63 91.44,71.63 T41.2
N$91
  Top 0.152: R65.2 71.02,53.34 72.85,55.17 73.61,55.17 T42.2
N$92
  Top 0.152: R61.2 69.95,82.6 71.17,82.6 73,84.43 73.61,84.43 T40.2
N$93
  Top 0.152: R61.1 59.74,82.45 59.74,77.57 R60.1 64.47,72.69 74.07,72.69 74.83,71.93 74.83,69.95 T38.1
N$94
  Bottom 0.152: T38.3 72.39,72.39 T39.1
N$95
  Top 0.152: R59.2 73,76.81 73.61,76.81 T39.2
N$96
  Top 0.152: R58.2 69.95,69.95 71.17,69.95 72.85,71.63 73.61,71.63 T38.2
N$97
  Top 0.152: R66.2 69.95,57.15 71.48,58.67 71.48,58.83 72.85,60.2 73.61,60.2 T43.2
N$98
  Top 0.152: R68.2 73,64.77 73.61,65.38 T44.2
N$100
  Top 0.152: R27.1 9.75,68.58 14.78,63.55 21.64,63.55 24.08,65.99 | 24.08,65.99 24.08,68.58 R30.1 | T42.1 74.98,53.34 74.98,58.37 T43.1 74.98,58.52 74.98,63.4 T44.1 | 24.08,65.99 31.7,65.99 35.51,62.18 55.17,62.18 55.47,61.87 58.67,61.87 59.59,60.96 R67.1
  Bottom 0.152: R67.1 68.58,60.96 72.08,64.47 73.91,64.47 74.83,63.55 T44.1
N$102
  Top 0.152: T24.1 39.47,77.57 41.91,77.57 R40.1
  Bottom 0.152: R37.1 24.23,81.23 33.07,81.23 35.81,78.49 38.41,78.49 39.32,77.57 T24.1
N$121
  Top 0.152: VALUE.A 77.57,92.81 77.57,82.6 R96.1
N$122
  Top 0.152: R95.2 87.63,78.79 88.85,78.79 90.68,80.62 91.44,80.62 T65.2
N$124
  Top 0.152: VALUE.K 81.38,93.88 81.38,92.05 92.66,80.77 92.66,78.79 T65.1
OUT
  Top 0.152: T33.1 92.66,27.89 92.66,24.69 90.83,22.86 T32.3 90.07,22.86 88.54,21.34 55.93,21.34 43.59,8.99 43.28,8.99 X3.4
RESET
  Top 0.152: R66.1 51.97,57.15 49.68,54.86 39.62,54.86 35.81,51.05 33.98,51.05 33.07,51.97 24.23,51.97 R23.1 24.08,51.97 23.16,51.05 23.16,30.18 25.3,28.04 25.3,8.99 X2.4
UP
  Bottom 0.152: 76.2,40.69 76.2,55.93 77.42,57.15 R55.1 | 76.2,40.69 76.2,39.32 77.42,38.1 77.42,35.66 R69.1 | 76.2,40.69 59.74,40.69 58.67,39.62 58.67,39.01 60.66,37.03 60.66,30.18 60.05,29.57 57.45,29.57 56.24,28.35 56.24,28.19 55.02,26.98 54.86,26.98 49.84,21.95 41.3,21.95 28.35,8.99 28.04,8.99 X2.5
VALUE
  Top 0.152: R95.1 77.42,78.64 76.5,77.72 76.5,64.47 77.42,63.55 77.42,60.96 R56.1 77.57,60.96 78.49,60.05 78.49,51.82 77.72,51.05 71.32,51.05 68.58,48.31 68.58,42.22 58.67,32.31 58.67,30.18 59.59,29.26 59.59,26.67 R11.1 | R38.1 41.91,60.05 | 41.91,60.05 R42.1 | T25.1 55.93,60.96 55.02,60.05 41.91,60.05
  Bottom 0.152: R11.1 59.59,26.67 55.63,22.71 55.63,18.9 45.72,8.99 X3.5 | T25.1 T23.1 57.15,66.14 57.3,66.29 74.07,66.29 77.42,62.94 77.42,60.96 R56.1 | R39.1 41.91,78.79 43.13,77.57 43.13,62.18 R38.1
VCC
  Top 0.152: R52.2 69.8,39.47 68.89,40.39 68.89,44.81 69.8,45.72 69.8,48.16 R54.2 69.95,48.31 76.2,48.31 77.11,49.23 86.11,49.23 86.72,48.62 | R50.2 87.63,34.29 86.72,35.2 86.72,42.22 87.63,43.13 R71.2 87.63,43.28 86.72,44.2 86.72,48.62 | R75.2 87.63,49.53 86.72,48.62 | 69.8,79.7 69.8,81.23 68.89,82.14 68.89,85.34 69.8,86.26 R62.2 | 69.8,79.7 69.8,77.57 R60.2 | R57.2 87.63,68.58 86.72,69.49 86.72,72.69 87.63,73.61 R64.2 87.63,73.76 86.72,74.68 86.72,79.1 | R96.2 87.63,80.01 86.72,79.1 | 69.8,79.7 86.11,79.7 86.72,79.1 | R31.2 34.29,76.2 33.38,77.11 33.38,80.31 | 33.38,80.31 34.29,81.23 R37.2 | 16.46,80.31 16.46,78.79 15.54,77.88 15.54,73.3 16.46,72.39 R28.2 | 16.46,80.31 16.46,81.23 R34.2 | 16.46,80.31 33.38,80.31 | R15.2 15.54,42.22 15.54,35.2 16.46,34.29 16.46,30.48 R3.2 | R6.2 33.38,29.57 33.38,26.21 33.83,25.76 38.41,25.76 40.39,23.77 40.39,22.55 39.78,21.95 39.62,21.95 34.29,16.61 R74.2 | R38.2 43.28,60.96 42.37,61.87 41,61.87 38.56,59.44 36.58,59.44 34.29,57.15 R24.2
  Bottom 0.152: R12.2 69.95,30.48 69.95,34.29 70.87,35.2 70.87,38.41 69.95,39.32 R52.2 | 69.95,59.74 69.95,58.37 70.87,57.45 70.87,49.23 69.95,48.31 R54.2 | 69.95,59.74 69.95,60.96 R67.2 | R47.2 52.12,35.66 52.12,38.1 53.03,39.01 53.03,47.24 52.12,48.16 R44.2 53.03,49.23 53.03,56.24 52.12,57.15 52.12,59.74 | 52.12,59.74 52.12,60.96 | 52.12,60.96 53.03,61.87 53.03,68.89 52.12,69.8 52.12,73.61 R41.2 | 52.12,60.96 R38.2 | 52.12,59.74 69.95,59.74 | R75.2 87.63,55.78 86.72,56.69 86.72,63.86 R57.2 | 16.61,60.66 16.61,63.55 17.53,64.47 17.53,71.48 16.61,72.39 R28.2 | 16.61,60.66 16.61,55.93 R21.2 | X2.1 19.66,7.01 23.16,7.01 23.93,7.77 23.93,9.6 30.79,16.46 34.29,16.46 R74.2 | 34.29,44.2 34.29,46.94 33.38,47.85 33.38,54.86 | 34.29,44.2 R18.2 | 33.38,54.86 34.29,55.78 R24.2 | R3.2 16.61,30.48 17.53,31.39 24.54,31.39 25.45,30.48 R6.2 34.59,30.79 38.56,30.79 39.78,29.57 42.37,29.57 43.28,30.48 R9.2 | 34.29,44.2 17.53,44.2 R15.2 | 16.61,60.66 27.58,60.66 33.38,54.86
WE
  Top 0.152: R43.1 41.91,51.97 41,51.05 41,47.85 41.91,46.94 R45.1 41.91,43.13 42.82,42.22 42.82,39.01 41,37.19 41,26.21 42.82,24.38 42.82,22.4 40.69,20.27 40.69,8.99 X3.3

### Text on the board
tPlace: Bit U/D Counter v1 ©2018 William Woody | D | LD | RST | UP | DN | OU | OD | WE | WO | OUT | VCC | GND